# Altium project ctrl_board.PrjPCB
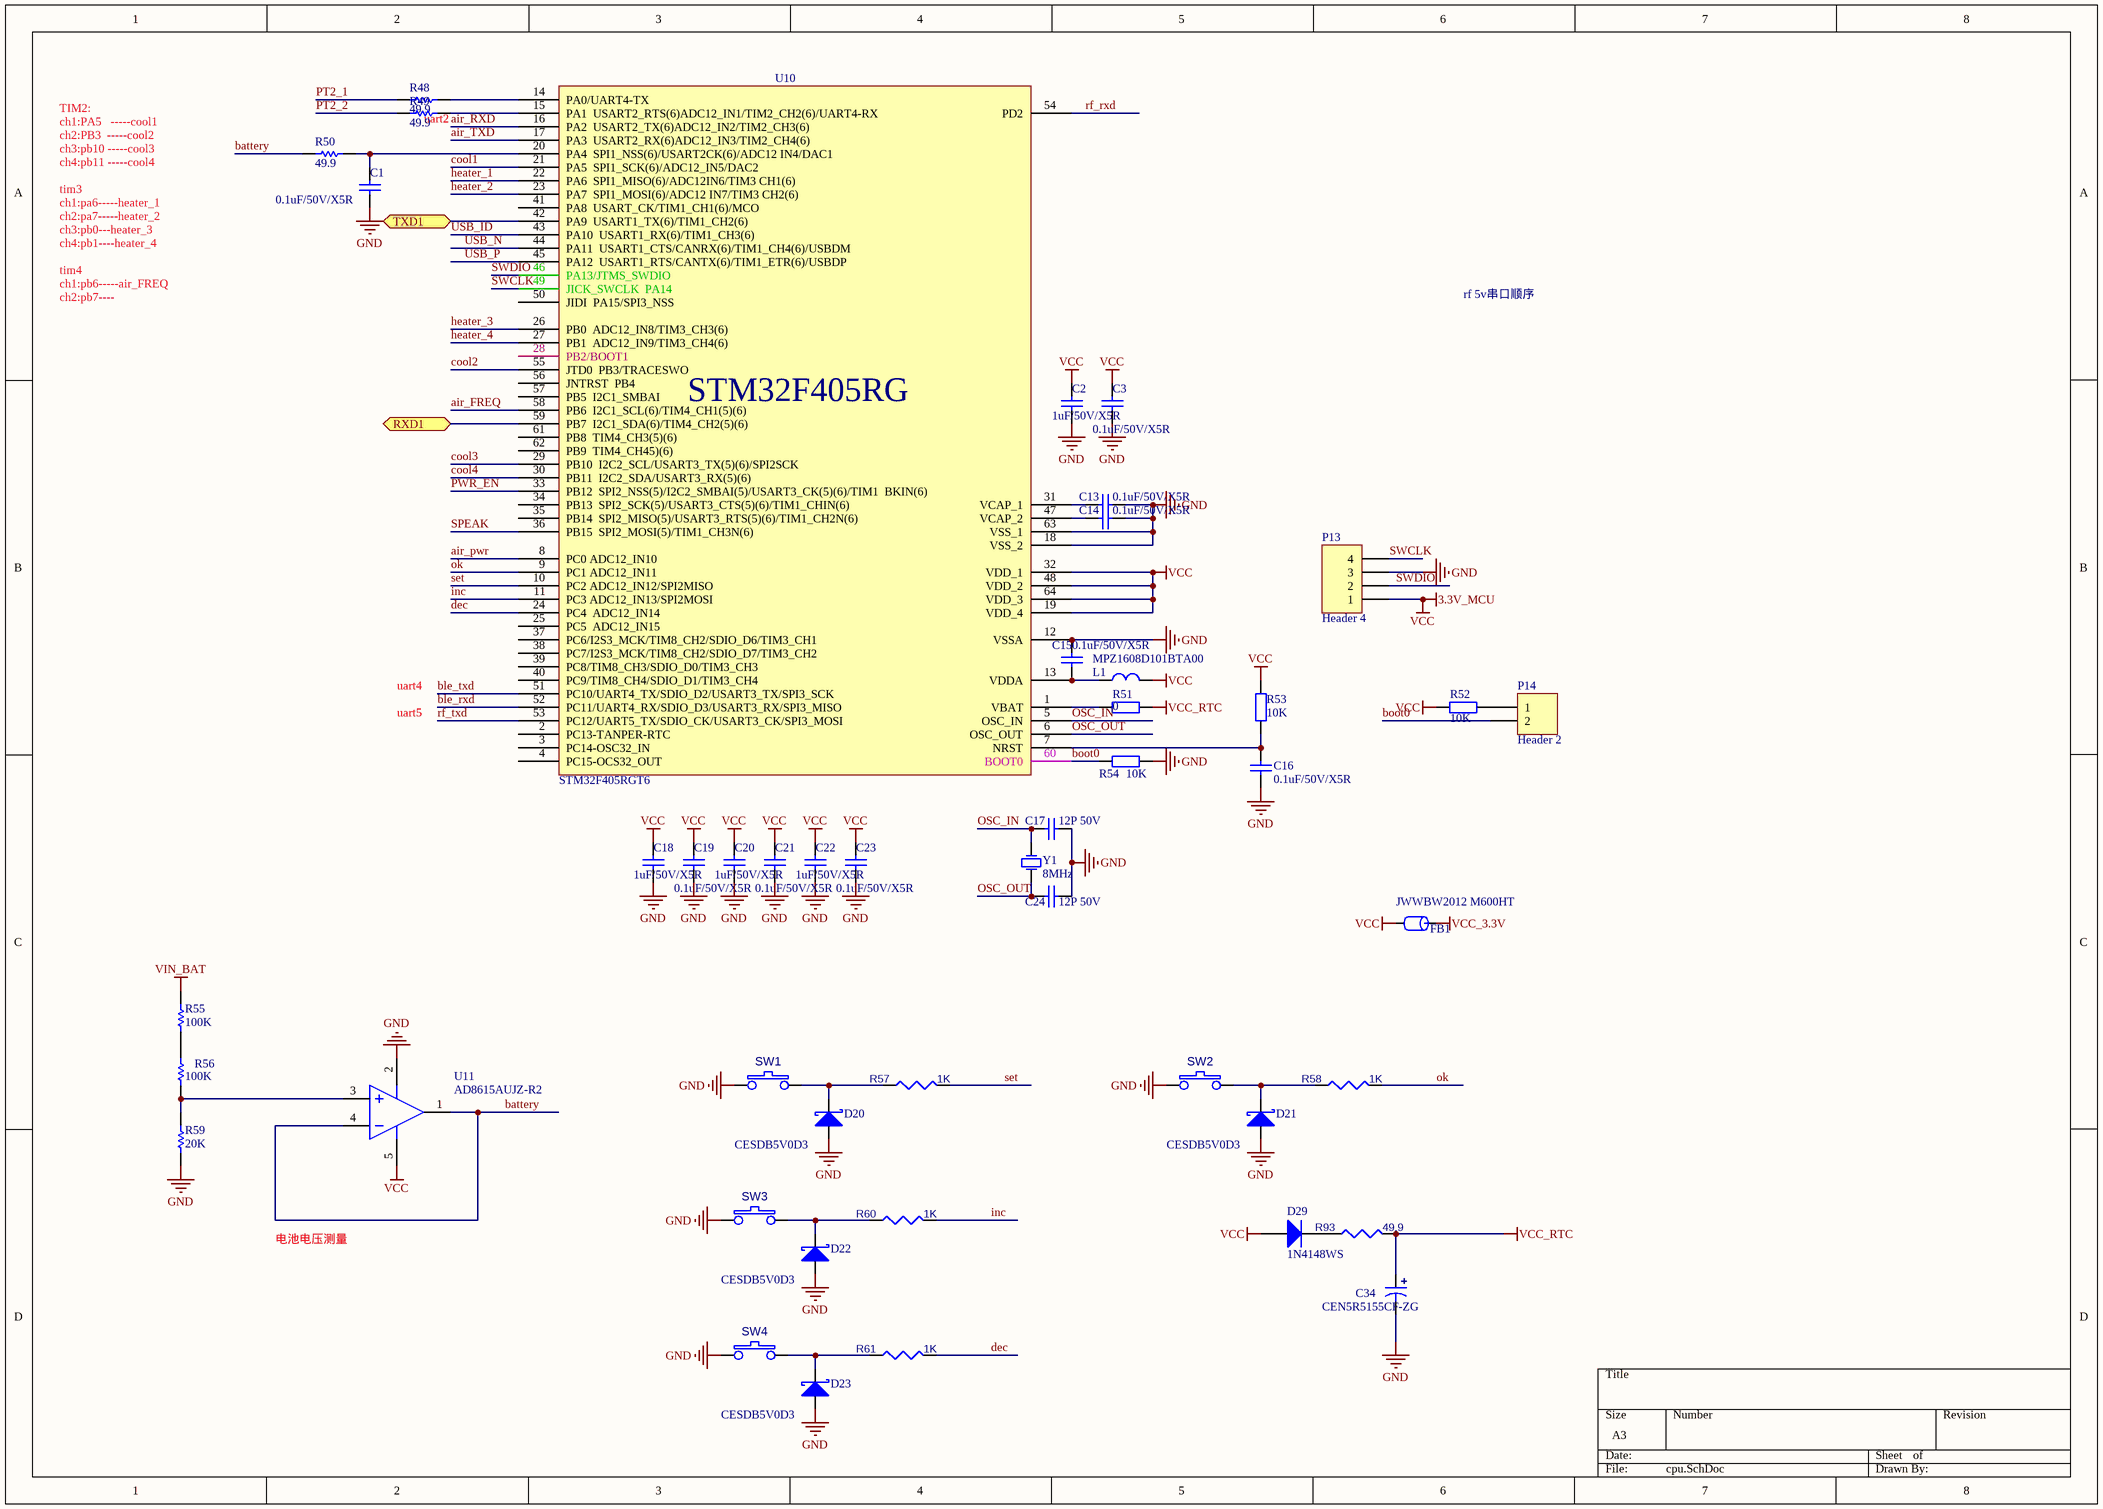
[diagram p0: cpu.SchDoc]
4 sheets, 192 parts. Net scope: global (net labels, ports and power ports of the same name join across sheets).
Board file: ctrl_boardV1.1.PcbDoc
Sheets:
  cpu.SchDoc
  pt100.SchDoc
  charge_drv.SchDoc
  charger.SchDoc

## Sheet cpu.SchDoc
size A3

### Parts
C1  0.1uF/50V/X5R  [0603C]
C2  1uF/50V/X5R  [0603C]
C3  0.1uF/50V/X5R  [0603C]
C13  0.1uF/50V/X5R  [0603C]
C14  0.1uF/50V/X5R  [0603C]
C15  0.1uF/50V/X5R  [0603C]
C16  0.1uF/50V/X5R  [0603C]
C17  12P 50V  [0603C]
C18  1uF/50V/X5R  [0603C]
C19  0.1uF/50V/X5R  [0603C]
C20  1uF/50V/X5R  [0603C]
C21  0.1uF/50V/X5R  [0603C]
C22  1uF/50V/X5R  [0603C]
C23  0.1uF/50V/X5R  [0603C]
C24  12P 50V  [0603C]
C34  CEN5R5155CF-ZG  [CAP-TH_BD21.0-P5.00-D0.8_CENXXX-CF]
D20  CESDB5V0D3  [SOD323]
D21  CESDB5V0D3  [SOD323]
D22  CESDB5V0D3  [SOD323]
D23  CESDB5V0D3  [SOD323]
D29  1N4148WS  [SOD323]
FB1  JWWBW2012 M600HT  [0805CZ]
L1  MPZ1608D101BTA00  [0603R]
P13  Header 4  [HDR1X4]
P14  Header 2  [HDR1X2]
R48  49.9  [0603R]
R49  49.9  [0603R]
R50  49.9  [0603R]
R51  0  [0603R]
R52  10K  [0603R]
R53  10K  [0603R]
R54  10K  [0603R]
R55  100K  [0603R]
R56  100K  [0603R]
R57  value 1K  [0603R]  (hidden comment: 1k/1%)
R58  value 1K  [0603R]  (hidden comment: 1k/1%)
R59  20K  [0603R]
R60  value 1K  [0603R]  (hidden comment: 1k/1%)
R61  value 1K  [0603R]  (hidden comment: 1k/1%)
R93  value 49.9  [0603R]  (hidden comment: 1k/1%)
SW1  SW PUSHBUTTON  [SW-SMD_L3.9-W3.0-P4.45]  (value not drawn)
SW2  SW PUSHBUTTON  [SW-SMD_L3.9-W3.0-P4.45]  (value not drawn)
SW3  SW PUSHBUTTON  [SW-SMD_L3.9-W3.0-P4.45]  (value not drawn)
SW4  SW PUSHBUTTON  [SW-SMD_L3.9-W3.0-P4.45]  (value not drawn)
U10  STM32F405RGT6  [LQFP-64]
U11  AD8615AUJZ-R2  [sot-23-5]
Y1  8MHz  [CRAY_5032]

### Ports
RXD1 (bidir), TXD1 (bidir)

### Nets
3.3V_MCU: C2.2 C3.2 C18.2 C19.2 C20.2 C21.2 C22.2 C23.2 D29.1(A) FB1.2 L1.2 P13.1 R52.2 R53.1 U10.19(VDD_4) U10.32(VDD_1) U10.48(VDD_2) U10.64(VDD_3) U11.5(VCC)  [also labelled VCC]
GND: C1.1 C2.1 C3.1 C13.1 C14.1 C15.1 C16.1 C17.1 C18.1 C19.1 C20.1 C21.1 C22.1 C23.1 C24.1 C34.2 D20.1(A) D21.1(A) D22.1(A) D23.1(A) P13.3 R54.2 R59.2 SW1.1 SW2.1 SW3.1 SW4.1 U10.12(VSSA) U10.18(VSS_2) U10.63(VSS_1) U11.2(G)
VCC_3.3V: FB1.1
VCC_RTC: C34.1 R51.1 R93.2
VIN_BAT: R55.1
air_FREQ: U10.58(PB6__I2C1_SCL(6)/TIM4_CH1(5)(6))
air_pwr: U10.8(PC0_ADC12_IN10)
air_RXD: U10.16(PA2__USART2_TX(6)ADC12_IN2/TIM2_CH3(6))
air_TXD: U10.17(PA3__USART2_RX(6)ADC12_IN3/TIM2_CH4(6))
battery: R50.1 U11.1(OS_NUL) U11.4(V-)
ble_rxd: U10.52(PC11/UART4_RX/SDIO_D3/USART3_RX/SPI3_MISO)
ble_txd: U10.51(PC10/UART4_TX/SDIO_D2/USART3_TX/SPI3_SCK)
boot0: P14.2 R54.1 U10.60(BOOT0)
cool1: U10.21(PA5__SPI1_SCK(6)/ADC12_IN5/DAC2)
cool2: U10.55(JTD0__PB3/TRACESWO)
cool3: U10.29(PB10__I2C2_SCL/USART3_TX(5)(6)/SPI2SCK)
cool4: U10.30(PB11__I2C2_SDA/USART3_RX(5)(6))
dec: R61.2 U10.24(PC4__ADC12_IN14)
heater_1: U10.22(PA6__SPI1_MISO(6)/ADC12IN6/TIM3_CH1(6))
heater_2: U10.23(PA7__SPI1_MOSI(6)/ADC12_IN7/TIM3_CH2(6))
heater_3: U10.26(PB0__ADC12_IN8/TIM3_CH3(6))
heater_4: U10.27(PB1__ADC12_IN9/TIM3_CH4(6))
inc: R60.2 U10.11(PC3_ADC12_IN13/SPI2MOSI)
ok: R58.2 U10.9(PC1_ADC12_IN11)
OSC_IN: C17.2 U10.5(OSC_IN) Y1.2(OSC2)
OSC_OUT: C24.2 U10.6(OSC_OUT) Y1.1(OSC1)
PT2_1: R48.1
PT2_2: R49.1
PWR_EN: U10.33(PB12__SPI2_NSS(5)/I2C2_SMBAI(5)/USART3_CK(5)(6)/TIM1__BKIN(6))
rf_rxd: U10.54(PD2)
rf_txd: U10.53(PC12/UART5_TX/SDIO_CK/USART3_CK/SPI3_MOSI)
set: R57.2 U10.10(PC2_ADC12_IN12/SPI2MISO)
SPEAK: U10.36(PB15__SPI2_MOSI(5)/TIM1_CH3N(6))
SWCLK: P13.4 U10.49(JICK_SWCLK__PA14)
SWDIO: P13.2 U10.46(PA13/JTMS_SWDIO)
USB_ID: U10.43(PA10__USART1_RX(6)/TIM1_CH3(6))
USB_N: U10.44(PA11__USART1_CTS/CANRX(6)/TIM1_CH4(6)/USBDM)
USB_P: U10.45(PA12__USART1_RTS/CANTX(6)/TIM1_ETR(6)/USBDP)
NetC1_2: C1.2 R50.2 U10.20(PA4__SPI1_NSS(6)/USART2CK(6)/ADC12_IN4/DAC1)
NetC13_2: C13.2 U10.31(VCAP_1)
NetC14_2: C14.2 U10.47(VCAP_2)
NetC15_2: C15.2 L1.1 U10.13(VDDA)
NetC16_2: C16.2 R53.2 U10.7(NRST)
NetD20_2: D20.2(K) R57.1 SW1.2
NetD21_2: D21.2(K) R58.1 SW2.2
NetD22_2: D22.2(K) R60.1 SW3.2
NetD23_2: D23.2(K) R61.1 SW4.2
NetD29_2: D29.2(K) R93.1
NetP14_1: P14.1 R52.1
NetR48_2: R48.2 U10.14(PA0/UART4-TX)
NetR49_2: R49.2 U10.15(PA1__USART2_RTS(6)ADC12_IN1/TIM2_CH2(6)/UART4-RX)
NetR51_2: R51.2 U10.1(VBAT)
NetR55_2: R55.2 R56.1
NetR56_2: R56.2 R59.1 U11.3(V+)
NetU10_42: U10.42(PA9__USART1_TX(6)/TIM1_CH2(6)) ; port TXD1
NetU10_59: U10.59(PB7__I2C1_SDA(6)/TIM4_CH2(5)(6)) ; port RXD1

Not connected (* = marked no-connect by the designer): U10 2(PC13-TANPER-RTC) 3(PC14-OSC32_IN) 4(PC15-OCS32_OUT) 25(PC5__ADC12_IN15) 28(PB2/BOOT1) 34(PB13__SPI2_SCK(5)/USART3_CTS(5)(6)/TIM1_CHIN(6)) 35(PB14__SPI2_MISO(5)/USART3_RTS(5)(6)/TIM1_CH2N(6)) 37(PC6/I2S3_MCK/TIM8_CH2/SDIO_D6/TIM3_CH1) 38(PC7/I2S3_MCK/TIM8_CH2/SDIO_D7/TIM3_CH2) 39(PC8/TIM8_CH3/SDIO_D0/TIM3_CH3) 40(PC9/TIM8_CH4/SDIO_D1/TIM3_CH4) 41(PA8__USART_CK/TIM1_CH1(6)/MCO) 50(JIDI__PA15/SPI3_NSS) 56(JNTRST__PB4) 57(PB5__I2C1_SMBAI) 61(PB8__TIM4_CH3(5)(6)) 62(PB9__TIM4_CH45)(6))

### Notes on the sheet
- (near R49) uart2
- TIM2:
  ch1:PA5   -----cool1
  ch2:PB3  -----cool2
  ch3:pb10 -----cool3
  ch4:pb11 -----cool4
  tim3
  ch1:pa6-----heater_1
  ch2:pa7-----heater_2
  ch3:pb0---heater_3
  ch4:pb1----heater_4
  tim4
  ch1:pb6-----air_FREQ
  ch2:pb7----
- rf 5v串口顺序
- uart4
- uart5
- 电池电压测量

### Library data of the parts
C1-C3 C13-C24 = CAP4: 贴片电容 20%
C34 = CAP2: 电解电容
D20-D23 = DIODE S: Schottky Diode
D29 = DIODE
FB1 = FB: Part Field 1: 磁珠/0603/1K ohm/100MHz; Text Field1: FB; Value: JWWBW2012 M600HT
L1 = CIZHU1: 磁珠电感 100R 100MHz
P13 = Header 4: Header, 4-Pin; LatestRevisionDate: 17-Jul-2002; LatestRevisionNote: Re-released for DXP Platform.; Publisher: Altium Limited
P14 = Header 2: Header, 2-Pin; LatestRevisionDate: 17-Jul-2002; LatestRevisionNote: Re-released for DXP Platform.; Publisher: Altium Limited
R48-R50 R55 R56 R59 = Res1: Resistor; Published: 8-Jun-2000; LatestRevisionDate: 17-Jul-2002; LatestRevisionNote: Re-released for DXP Platform.; PackageReference: AXIAL-0.3; Publisher: Altium Limited
R51-R54 = RES2: 贴片电阻 5%
R57 R58 R60 R61 R93 = RESISTOR_0: Part Reference: R70; SIGNAL_MODEL: DEFAULT_RESISTOR_200OHM_1_2; PCB Footprint: R0402
SW1-SW4 = SW PUSHBUTTON: Part Reference: SW2; PCB Footprint: KEY_3X6; Value: SW PUSHBUTTON
U10 = STM32F405RG: MCU
U11 = AD8615
Y1 = XTAL: 晶振

## Sheet pt100.SchDoc
size A4
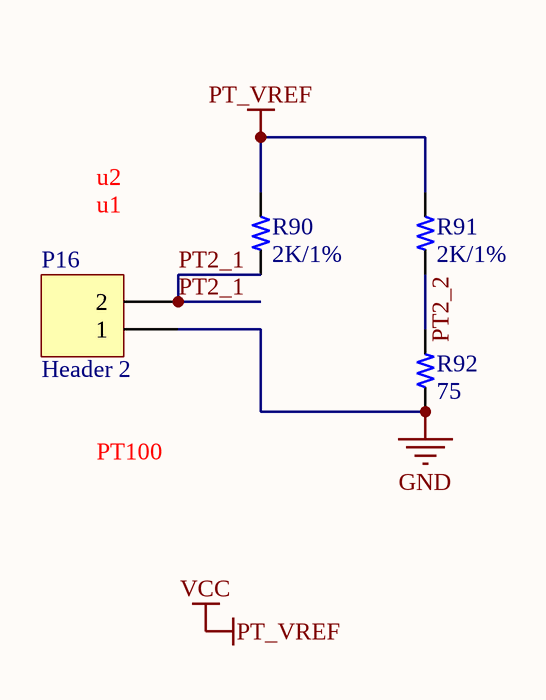
[diagram p1: pt100.SchDoc]

### Parts
P16  Header 2  [KF250NH-3.5-2P]
R90  2K/1%  [0603R]
R91  2K/1%  [0603R]
R92  75  [0603R]

### Nets
GND: P16.1 R92.1
PT_VREF: R90.2 R91.2  [also labelled VCC]  [project net 3.3V_MCU]
PT2_1: P16.2 R90.1
PT2_2: R91.1 R92.2

### Notes on the sheet
- (near P16) u1
- u2
- PT100

### Library data of the parts
R90-R92 = R
  R90 R91: Value: 2K/1%
  R92: Value: 75
P16 = Header 2: Publisher: Altium Limited; Value: Header 2

## Sheet charge_drv.SchDoc
size A2
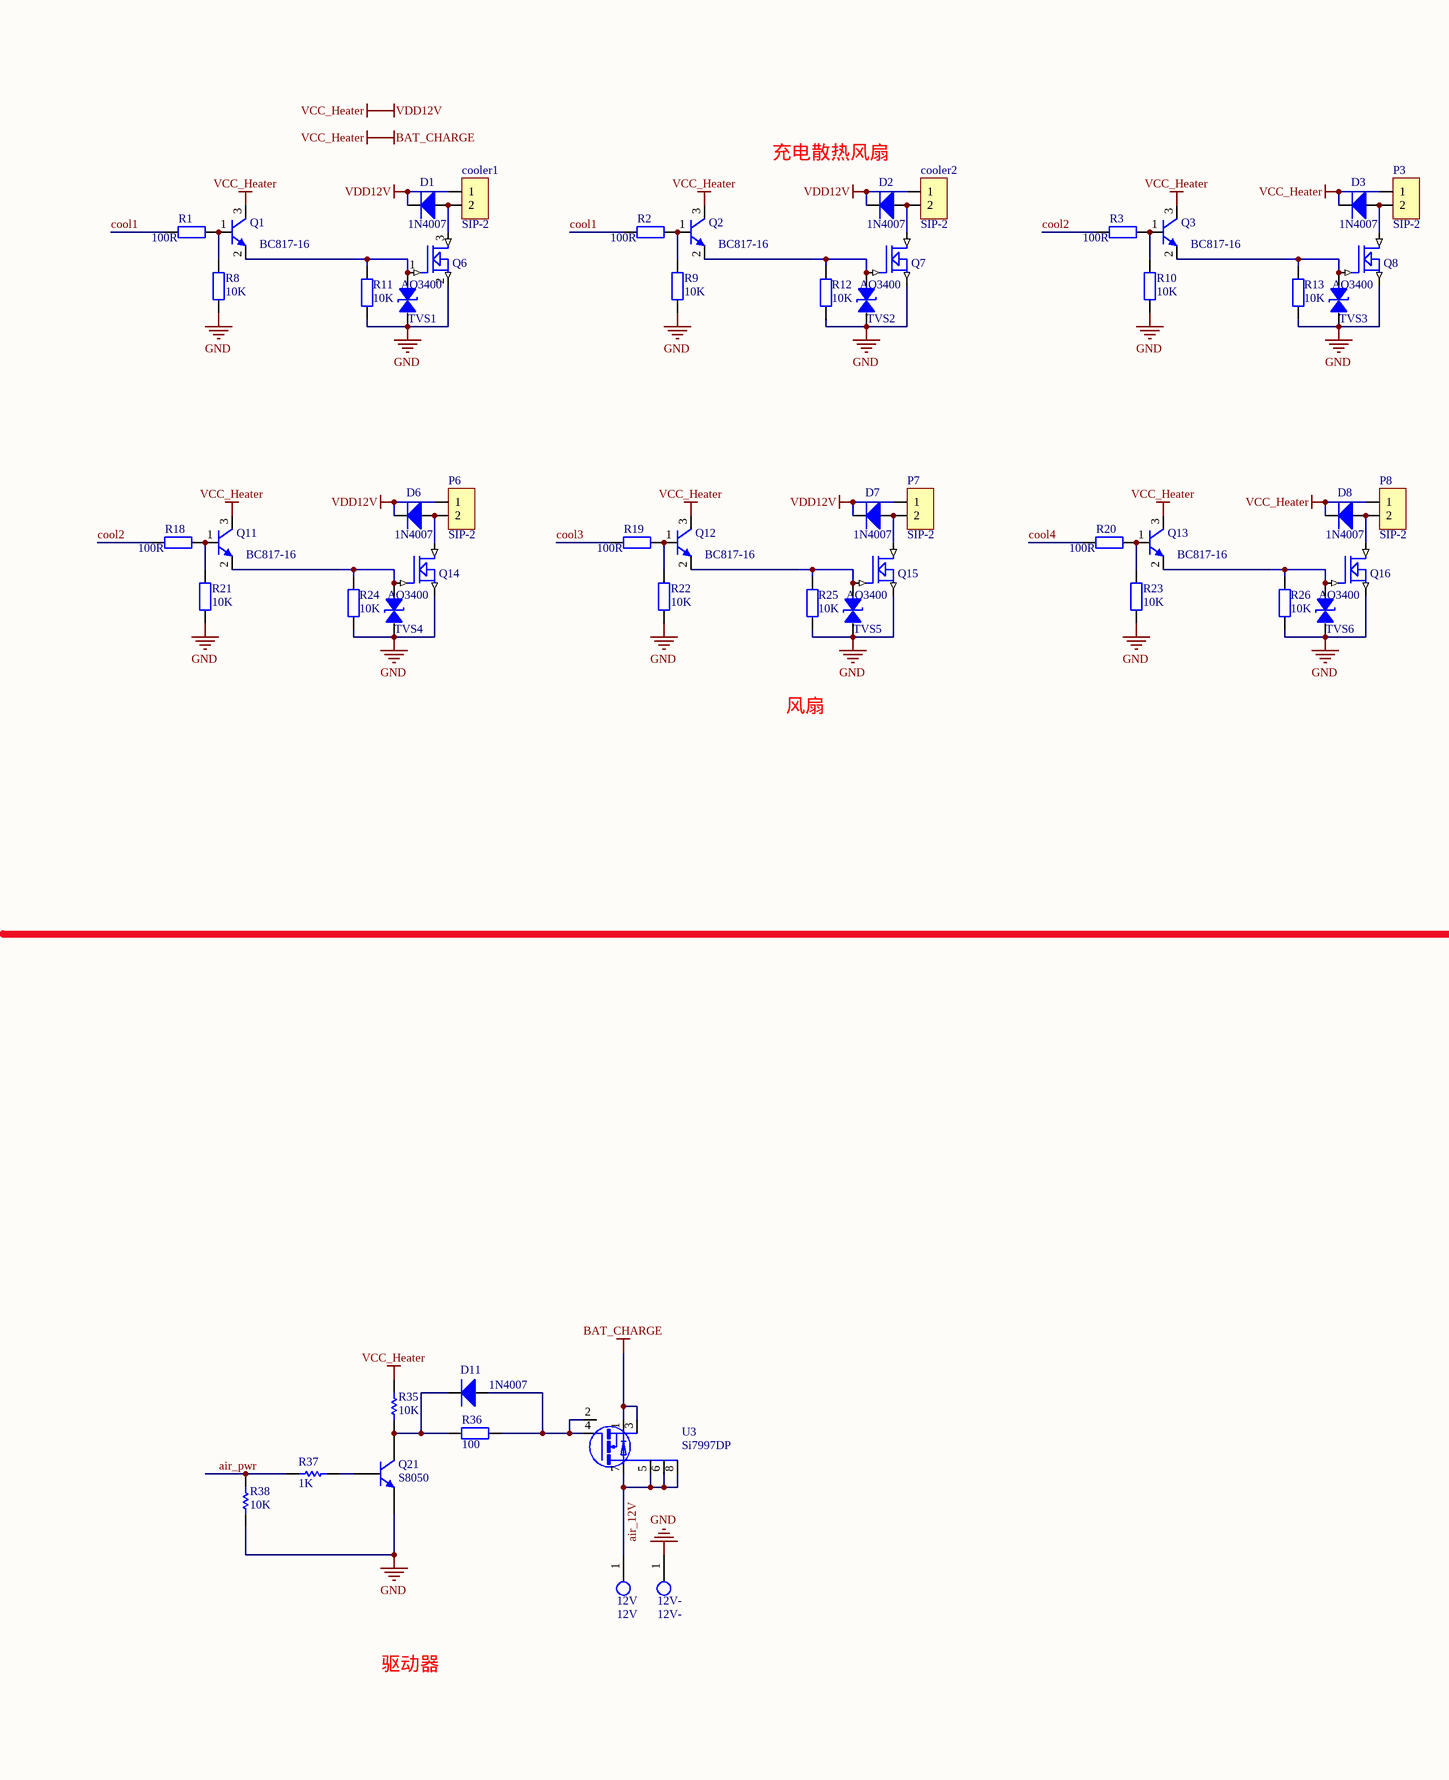
[diagram p2: charge_drv.SchDoc, left]
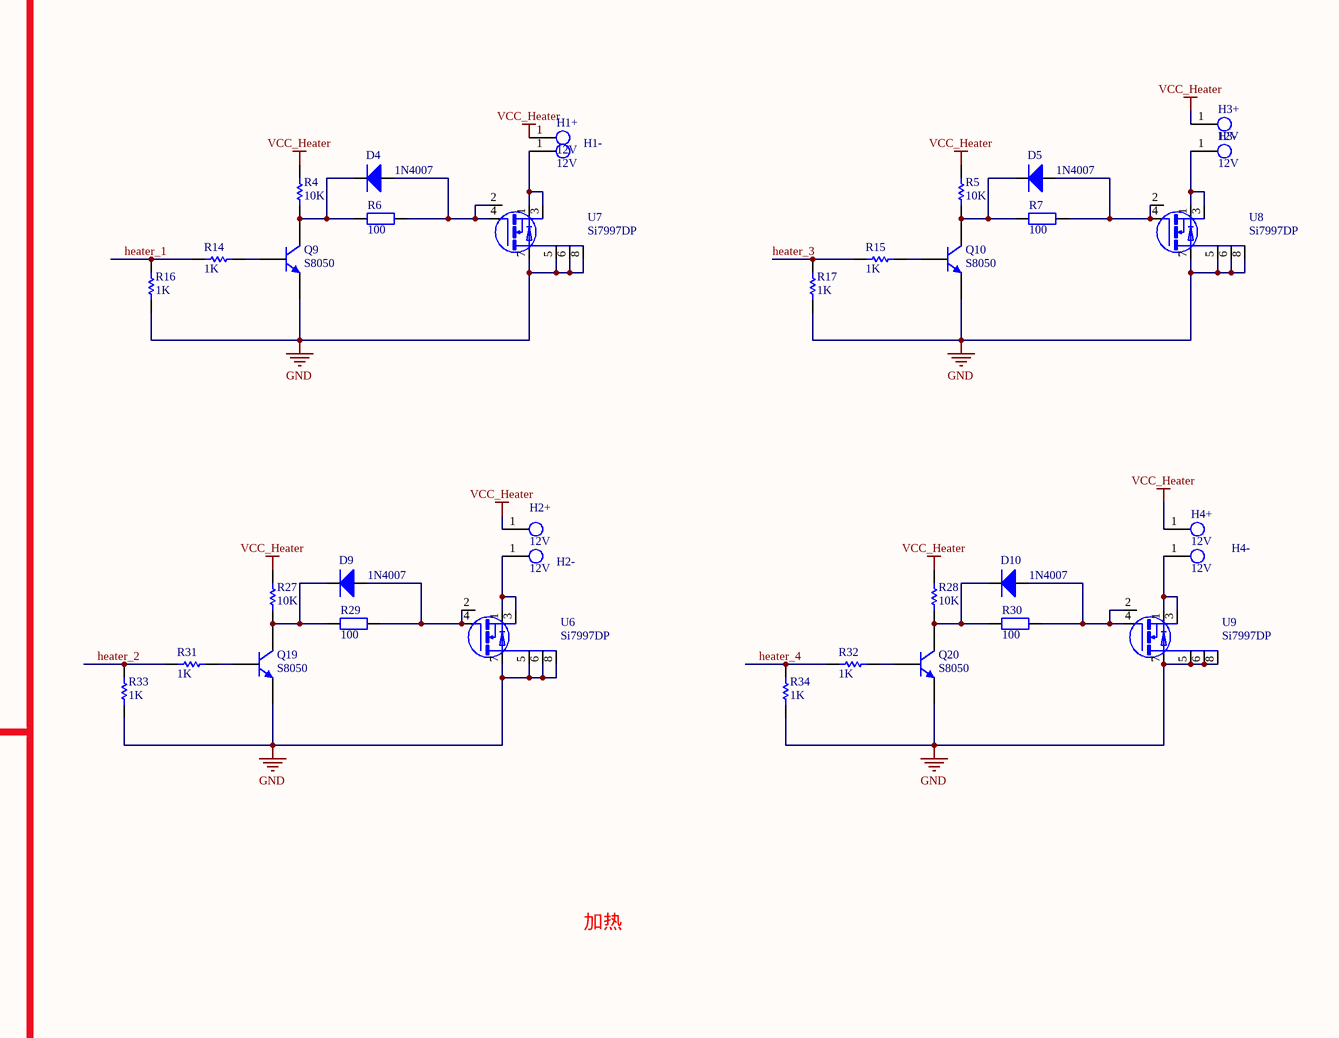
[diagram p3: charge_drv.SchDoc, right]

### Parts
12V  12V  [FIX-4.5]
12V-  12V-  [FIX-4.5]
cooler1  SIP-2  [SIP-2A]
cooler2  SIP-2  [SIP-2A]
D1  1N4007  [DO-214-AC]
D2  1N4007  [DO-214-AC]
D3  1N4007  [DO-214-AC]
D4  1N4007  [DO-214-AC]
D5  1N4007  [DO-214-AC]
D6  1N4007  [DO-214-AC]
D7  1N4007  [DO-214-AC]
D8  1N4007  [DO-214-AC]
D9  1N4007  [DO-214-AC]
D10  1N4007  [DO-214-AC]
D11  1N4007  [DO-214-AC]
H1+  12V  [FIX-4.5]
H1-  12V  [FIX-4.5]
H2+  12V  [FIX-4.5]
H2-  12V  [FIX-4.5]
H3+  12V  [FIX-4.5]
H3-  12V  [FIX-4.5]
H4+  12V  [FIX-4.5]
H4-  12V  [FIX-4.5]
P3  SIP-2  [SIP-2A]
P6  SIP-2  [SIP-2A]
P7  SIP-2  [SIP-2A]
P8  SIP-2  [SIP-2A]
Q1  BC817-16  [SOT23-3]
Q2  BC817-16  [SOT23-3]
Q3  BC817-16  [SOT23-3]
Q6  AO3400  [SOT23-3]
Q7  AO3400  [SOT23-3]
Q8  AO3400  [SOT23-3]
Q9  S8050  [SOT23-3]
Q10  S8050  [SOT23-3]
Q11  BC817-16  [SOT23-3]
Q12  BC817-16  [SOT23-3]
Q13  BC817-16  [SOT23-3]
Q14  AO3400  [SOT23-3]
Q15  AO3400  [SOT23-3]
Q16  AO3400  [SOT23-3]
Q19  S8050  [SOT23-3]
Q20  S8050  [SOT23-3]
Q21  S8050  [SOT23-3]
R1  100R  [0603R]
R2  100R  [0603R]
R3  100R  [0603R]
R4  10K  [0603R]
R5  10K  [0603R]
R6  100  [0603R]
R7  100  [0603R]
R8  10K  [0603R]
R9  10K  [0603R]
R10  10K  [0603R]
R11  10K  [0603R]
R12  10K  [0603R]
R13  10K  [0603R]
R14  1K  [0603R]
R15  1K  [0603R]
R16  1K  [0603R]
R17  1K  [0603R]
R18  100R  [0603R]
R19  100R  [0603R]
R20  100R  [0603R]
R21  10K  [0603R]
R22  10K  [0603R]
R23  10K  [0603R]
R24  10K  [0603R]
R25  10K  [0603R]
R26  10K  [0603R]
R27  10K  [0603R]
R28  10K  [0603R]
R29  100  [0603R]
R30  100  [0603R]
R31  1K  [0603R]
R32  1K  [0603R]
R33  1K  [0603R]
R34  1K  [0603R]
R35  10K  [0603R]
R36  100  [0603R]
R37  1K  [0603R]
R38  10K  [0603R]
TVS1  ESD5Z5.0CT1G  [SOD-523]  (value not drawn)
TVS2  ESD5Z5.0CT1G  [SOD-523]  (value not drawn)
TVS3  ESD5Z5.0CT1G  [SOD-523]  (value not drawn)
TVS4  ESD5Z5.0CT1G  [SOD-523]  (value not drawn)
TVS5  ESD5Z5.0CT1G  [SOD-523]  (value not drawn)
TVS6  ESD5Z5.0CT1G  [SOD-523]  (value not drawn)
U3  Si7997DP  [PowerPAK SO-8]
U6  Si7997DP  [PowerPAK SO-8]
U7  Si7997DP  [PowerPAK SO-8]
U8  Si7997DP  [PowerPAK SO-8]
U9  Si7997DP  [PowerPAK SO-8]

### Nets
BAT_CHARGE: cooler1.1 cooler2.1 D1.2(K) D2.2(K) D3.2(K) D6.2(K) D7.2(K) D8.2(K) H1+.1 H2+.1 H3+.1 H4+.1 P3.1 P6.1 P7.1 P8.1 Q1.3(C) Q2.3(C) Q3.3(C) Q11.3(C) Q12.3(C) Q13.3(C) R4.2 R5.2 R27.2 R28.2 R35.2 U3.1(S) U3.3(S)  [also labelled VCC_Heater, VDD12V]
GND: 12V-.1 Q6.2(S) Q7.2(S) Q8.2(S) Q9.2(E) Q10.2(E) Q14.2(S) Q15.2(S) Q16.2(S) Q19.2(E) Q20.2(E) Q21.2(E) R8.1 R9.1 R10.1 R11.2 R12.2 R13.2 R16.2 R17.2 R21.1 R22.1 R23.1 R24.2 R25.2 R26.2 R33.2 R34.2 R38.2 TVS1.1(A) TVS2.1(A) TVS3.1(A) TVS4.1(A) TVS5.1(A) TVS6.1(A) U6.5(D) U6.6(D) U6.7(D) U6.8(D) U7.5(D) U7.6(D) U7.7(D) U7.8(D) U8.5(D) U8.6(D) U8.7(D) U8.8(D) U9.5(D) U9.6(D) U9.7(D) U9.8(D)
air_12V: 12V.1 U3.5(D) U3.6(D) U3.7(D) U3.8(D)
air_pwr: R37.2 R38.1
cool1: R1.2 R2.2
cool2: R3.2 R18.2
cool3: R19.2
cool4: R20.2
heater_1: R14.2 R16.1
heater_2: R31.2 R33.1
heater_3: R15.2 R17.1
heater_4: R32.2 R34.1
Netcooler1_2: cooler1.2 D1.1(A) Q6.3(D)
Netcooler2_2: cooler2.2 D2.1(A) Q7.3(D)
NetD3_1: D3.1(A) P3.2 Q8.3(D)
NetD4_1: D4.1(A) R6.2 U7.2(G) U7.4(G)
NetD4_2: D4.2(K) Q9.3(C) R4.1 R6.1
NetD5_1: D5.1(A) R7.2 U8.2(G) U8.4(G)
NetD5_2: D5.2(K) Q10.3(C) R5.1 R7.1
NetD6_1: D6.1(A) P6.2 Q14.3(D)
NetD7_1: D7.1(A) P7.2 Q15.3(D)
NetD8_1: D8.1(A) P8.2 Q16.3(D)
NetD9_1: D9.1(A) R29.2 U6.2(G) U6.4(G)
NetD9_2: D9.2(K) Q19.3(C) R27.1 R29.1
NetD10_1: D10.1(A) R30.2 U9.2(G) U9.4(G)
NetD10_2: D10.2(K) Q20.3(C) R28.1 R30.1
NetD11_1: D11.1(A) R36.2 U3.2(G) U3.4(G)
NetD11_2: D11.2(K) Q21.3(C) R35.1 R36.1
NetH1-_1: H1-.1 U7.1(S) U7.3(S)
NetH2-_1: H2-.1 U6.1(S) U6.3(S)
NetH3-_1: H3-.1 U8.1(S) U8.3(S)
NetH4-_1: H4-.1 U9.1(S) U9.3(S)
NetQ1_1: Q1.1(B) R1.1 R8.2
NetQ1_2: Q1.2(E) Q6.1(G) R11.1 TVS1.2(B)
NetQ2_1: Q2.1(B) R2.1 R9.2
NetQ2_2: Q2.2(E) Q7.1(G) R12.1 TVS2.2(B)
NetQ3_1: Q3.1(B) R3.1 R10.2
NetQ3_2: Q3.2(E) Q8.1(G) R13.1 TVS3.2(B)
NetQ9_1: Q9.1(B) R14.1
NetQ10_1: Q10.1(B) R15.1
NetQ11_1: Q11.1(B) R18.1 R21.2
NetQ11_2: Q11.2(E) Q14.1(G) R24.1 TVS4.2(B)
NetQ12_1: Q12.1(B) R19.1 R22.2
NetQ12_2: Q12.2(E) Q15.1(G) R25.1 TVS5.2(B)
NetQ13_1: Q13.1(B) R20.1 R23.2
NetQ13_2: Q13.2(E) Q16.1(G) R26.1 TVS6.2(B)
NetQ19_1: Q19.1(B) R31.1
NetQ20_1: Q20.1(B) R32.1
NetQ21_1: Q21.1(B) R37.1

### Notes on the sheet
- 充电散热风扇
- 风扇
- 加热
- 驱动器

### Library data of the parts
12V 12V- H1+ H1- H2+ H2- H3+ H3- H4+ H4- = TP
cooler1 cooler2 P3 P6-P8 = SIP-2: XH2.54 2P 立贴
D1-D11 = DIODE2: 贴片二极管
Q1-Q3 Q11-Q13 = NPN-1: 三极管
Q6-Q8 Q14-Q16 = MOSFET N
Q9 Q10 Q19-Q21 = NPN: NPN Bipolar Transistor; Published: 8-Jun-2000; LatestRevisionDate: 17-Jul-2002; LatestRevisionNote: Re-released for DXP Platform.; PackageReference: TO-226; Publisher: Altium Limited; Code_JEDEC: TO-226-AA
R1-R3 R6-R13 R18-R26 R29 R30 R36 = RES-SOP: 贴片电阻 5%
R4 R5 R14-R17 R27 R28 R31-R35 R37 R38 = Res1: Resistor; Published: 8-Jun-2000; LatestRevisionDate: 17-Jul-2002; LatestRevisionNote: Re-released for DXP Platform.; PackageReference: AXIAL-0.3; Publisher: Altium Limited
TVS1-TVS6 = TVS-1: TVS
U3 U6-U9 = Si7997DP: Sia430DJ

## Sheet charger.SchDoc
size A3
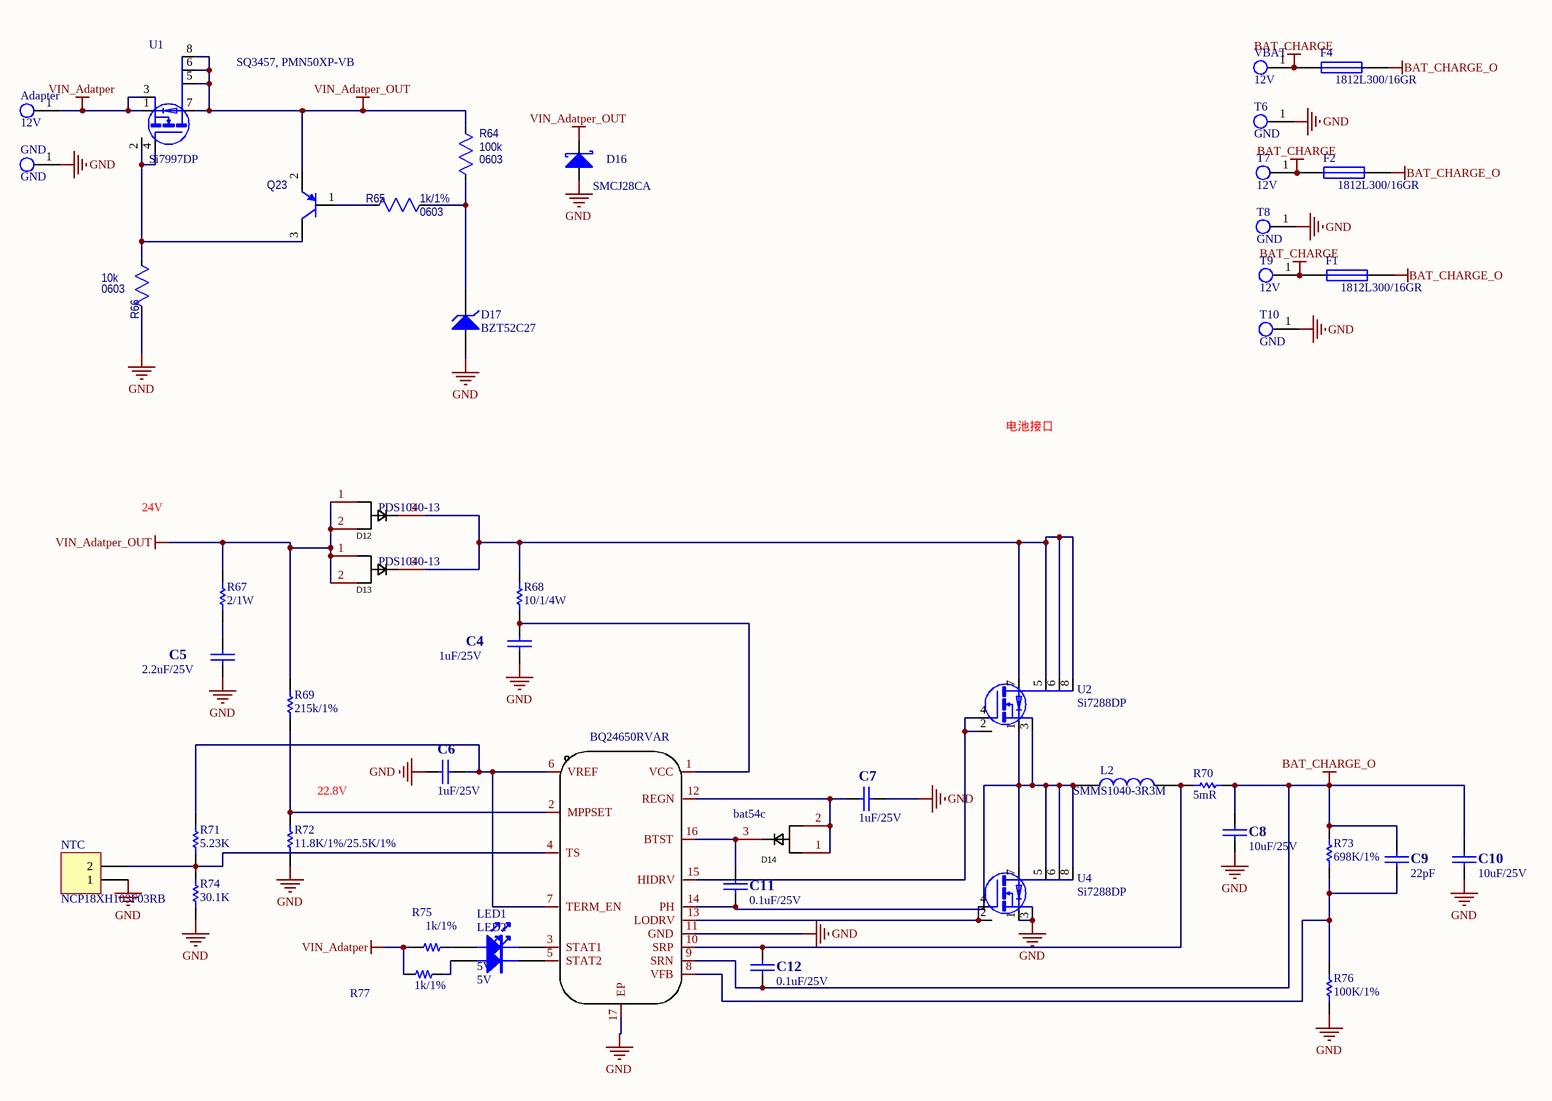
[diagram p4: charger.SchDoc]

### Parts
Adapter  12V  [FIX-4.5]
C4  1uF/25V  [0805C]
C5  2.2uF/25V  [1210C]
C6  1uF/25V  [0603C]
C7  1uF/25V  [0603C]
C8  10uF/25V  [0603C]
C9  22pF  [0603C]
C10  10uF/25V  [0603C]
C11  0.1uF/25V  [0603C]
C12  0.1uF/25V  [0603C]
D12  PDS1040-13  [POWERDI-5_L5.4-W4.0-LS6.5-RD]
D13  PDS1040-13  [POWERDI-5_L5.4-W4.0-LS6.5-RD]
D14  bat54c  [sot23-3]
D16  SMCJ28CA  [SMC]
D17  BZT52C27  [sod123]
F1  1812L300/16GR  [1812-F]
F2  1812L300/16GR  [1812-F]
F4  1812L300/16GR  [1812-F]
GND  GND  [FIX-4.5]
L2  SMMS1040-3R3M  [MSS1038]
LED1  5V  [0603LED]
LED2  5V  [0603LED]
NTC  NCP18XH103F03RB  [HDR1X2]
Q23  MMBT4403-7-F  [SOT23-3]  (value not drawn)
R64  Package: 0603  [RESC1608X055N_0603]  (hidden comment: 100k)
R65  Package: 0603  [RESC1608X055N_0603]  (hidden comment: 1k/1%)
R66  Package: 0603  [RESC1608X055N_0603]  (hidden comment: 10k)
R67  2/1W  [2512R]
R68  10/1/4W  [1206R]
R69  215k/1%  [0603R]
R70  5mR  [2512R]
R71  5.23K  [0603R]
R72  11.8K/1%/25.5K/1%  [0603R]
R73  698K/1%  [0603R]
R74  30.1K  [0603R]
R75  1k/1%  [0603R]
R76  100K/1%  [0603R]
R77  1k/1%  [0603R]
T6  GND  [FIX-4.5]
T7  12V  [FIX-4.5]
T8  GND  [FIX-4.5]
T9  12V  [FIX-4.5]
T10  GND  [FIX-4.5]
U1  Si7997DP  [PowerPAK SO-8]
U2  Si7288DP  [PowerPAK SO-8]
U4  Si7288DP  [PowerPAK SO-8]
U5  BQ24650RVAR  [VQFN-16_L3.6-W3.6-P0.50-BL-EP]
VBAT  12V  [FIX-4.5]

### Nets
BAT_CHARGE: F1.1 F2.1 F4.1 T7.1 T9.1 VBAT.1
BAT_CHARGE_O: C8.2 C9.2 C10.2 C12.1 F1.2 F2.2 F4.2 R70.2 R73.1 U5.9(SRN)
GND: C4.2 C5.2 C6.1 C7.2 C8.1 C10.1 D16.1(A) D17.1(A) GND.1 NTC.1 R66.2 R72.2 R74.2 R76.2 T6.1 T8.1 T10.1 U4.1(S) U4.3(S) U5.11(GND) U5.17(EP)
VIN_Adatper: Adapter.1 R75.2 R77.2 U1.1(S) U1.3(S)
VIN_Adatper_OUT: D12.1(LEFT) D12.2(RIGHT) D13.1(LEFT) D13.2(RIGHT) D16.2(K) Q23.2(E) R64.2 R67.1 R69.1 U1.5(D) U1.6(D) U1.7(D) U1.8(D)
NetC4_1: C4.1 R68.2 U5.1(VCC)
NetC5_1: C5.1 R67.2
NetC6_2: C6.2 R71.1 U5.6(VREF) U5.7(TERM_EN)
NetC7_1: C7.1 D14.1(LEFT) D14.2(RIGHT) U5.12(REGN)
NetC9_1: C9.1 R73.2 R76.1 U5.8(VFB)
NetC11_1: C11.1 L2.1 U2.1(S) U2.3(S) U4.5(D) U4.6(D) U4.7(D) U4.8(D) U5.14(PH)
NetC11_2: C11.2 D14.3 U5.16(BTST)
NetC12_2: C12.2 L2.2 R70.1 U5.10(SRP)
NetD12_3: D12.3 D13.3 R68.1 U2.5(D) U2.6(D) U2.7(D) U2.8(D)
NetD17_2: D17.2(K) R64.1 R65.1
NetLED1_1: LED1.1 R75.1
NetLED1_2: LED1.2 U5.3(STAT1)
NetLED2_1: LED2.1 R77.1
NetLED2_2: LED2.2 U5.5(STAT2)
NetNTC_2: NTC.2 R71.2 R74.1 U5.4(TS)
NetQ23_1: Q23.1(B) R65.2
NetQ23_3: Q23.3(C) R66.1 U1.2(G) U1.4(G)
NetR69_2: R69.2 R72.1 U5.2(MPPSET)
NetU2_2: U2.2(G) U2.4(G) U5.15(HIDRV)
NetU4_2: U4.2(G) U4.4(G) U5.13(LODRV)

### Notes on the sheet
- SQ3457, PMN50XP-VB
- 电池接口
- 24V
- (near R72) 22.8V

### Library data of the parts
Adapter GND T6-T10 VBAT = TP
C4-C12 = CAP: Capacitor
D12-D14 = PDS1040-13: Manufacturer: DIODES(美台); Add into BOM: yes; Forward Voltage (Vf@If): 510mV@10A; Reverse Voltage (Vr): 40V; Average Rectified Current (Io): 10A; Symbol: PDS1040-13; Device: PDS1040-13; LCSC Part Name: 电压:40V 电流:10A; Supplier Part: C110512; Manufacturer Part: PDS1040-13; Supplier Footprint: Power-DI-5; JLCPCB Part Class: Extended Part; Datasheet: https://atta.szlcsc.com/upload/public/pdf/source/20170427/1493286399327.pdf; Supplier: LCSC; Convert to PCB: yes
D16 = DIODE S: Schottky Diode
D17 = BZT52C12S-7-F: Zener Current: 5mA; Vz - Zener Voltage: 12V; Pd - Power Dissipation: 200mW; Zz - Zener Impedance: 40Ohms; Unit Weight: 0.000173oz; Voltage Temperature Coefficient: 0.25mV/C; Voltage Tolerance: 5%; Package Reference: SOD323-2; Minimum Operating Temperature: -65C; Packaging: Reel; Product Category: ZenerDiodes; Termination Style: SMD/SMT; Mounting Style: SMD/SMT; RoHS: True; Package / Case: SOD-323; Package Description: 2-Pin Surface Mount Device, Body 1.7 x 1.3 mm; Width: 1.4mm; Mounting Technology: SurfaceMount; Package URL: http://www.vishay.com/docs/71192/71192.pdf; Series: BZT52C12; Value: BZT52C12S-7-F
F1 F2 F4 = Fuse 1: Fuse; Published: 8-Jun-2000; LatestRevisionDate: 17-Jul-2002; LatestRevisionNote: Re-released for DXP Platform.; PackageReference: PIN-W2/E2.8; Publisher: Altium Limited; PackageDescription: Thru-Hole; 2 Leads
L2 = INDUCTOR
LED1 LED2 = LED
NTC = Header 2: XH2.54 2P 立贴; LatestRevisionDate: 17-Jul-2002; LatestRevisionNote: Re-released for DXP Platform.; Publisher: Altium Limited
Q23 = OEM_Diodes_MMBT4403: Supplier 1: *; Supplier Part Number 1: *; Value: MMBT4403-7-F
R64 = Resistor_0603: PartNumber: RC0603FR-0716K9L; Power Rating: [power]; TempCo: [tempco]; Tolerance: tol; Value: 100k; SupplierDescription: RES SMD 16.9K OHM 1% 1/10W 0603
R65 R66 = Resistor_0603: PartNumber: RC0603FR-071KL; Power Rating: [power]; TempCo: [tempco]; Tolerance: tol; SupplierDescription: RES SMD 1K OHM 1% 1/10W 0603
  R65: Value: 1k/1%
  R66: Value: 10k
R67-R74 R76 = Res1: Resistor; Published: 8-Jun-2000; LatestRevisionDate: 17-Jul-2002; LatestRevisionNote: Re-released for DXP Platform.; PackageReference: AXIAL-0.3; Publisher: Altium Limited
R75 R77 = R: Value: 1k/1%
U1 U2 U4 = Si7997DP: Sia430DJ
U5 = BQ24650RVAR: Manufacturer: TI(德州仪器); Add into BOM: yes; Symbol: BQ24650RVAR; Device: BQ24650RVAR; Supplier: LCSC; Manufacturer Part: BQ24650RVAR; Supplier Part: C53712; JLCPCB Part Class: Extended Part; LCSC Part Name: BQ24650RVAR; Supplier Footprint: VQFN-16-EP(3.6x3.6); Datasheet: https://www.ti.com/cn/lit/gpn/bq24650; Convert to PCB: yes

## Nets that join several sheets
3.3V_MCU: cpu (19 pins), pt100 (R90.2 R91.2)
BAT_CHARGE: charge_drv (29 pins), charger (6 pins)
GND: cpu (31 pins), pt100 (P16.1 R92.1), charge_drv (51 pins), charger (21 pins)
air_pwr: cpu (U10.8), charge_drv (R37.2 R38.1)
cool1: cpu (U10.21), charge_drv (R1.2 R2.2)
cool2: cpu (U10.55), charge_drv (R3.2 R18.2)
cool3: cpu (U10.29), charge_drv (R19.2)
cool4: cpu (U10.30), charge_drv (R20.2)
heater_1: cpu (U10.22), charge_drv (R14.2 R16.1)
heater_2: cpu (U10.23), charge_drv (R31.2 R33.1)
heater_3: cpu (U10.26), charge_drv (R15.2 R17.1)
heater_4: cpu (U10.27), charge_drv (R32.2 R34.1)
PT2_1: cpu (R48.1), pt100 (P16.2 R90.1)
PT2_2: cpu (R49.1), pt100 (R91.1 R92.2)